# EAGLE schematic PDB2 (EAGLE 9.5.1)
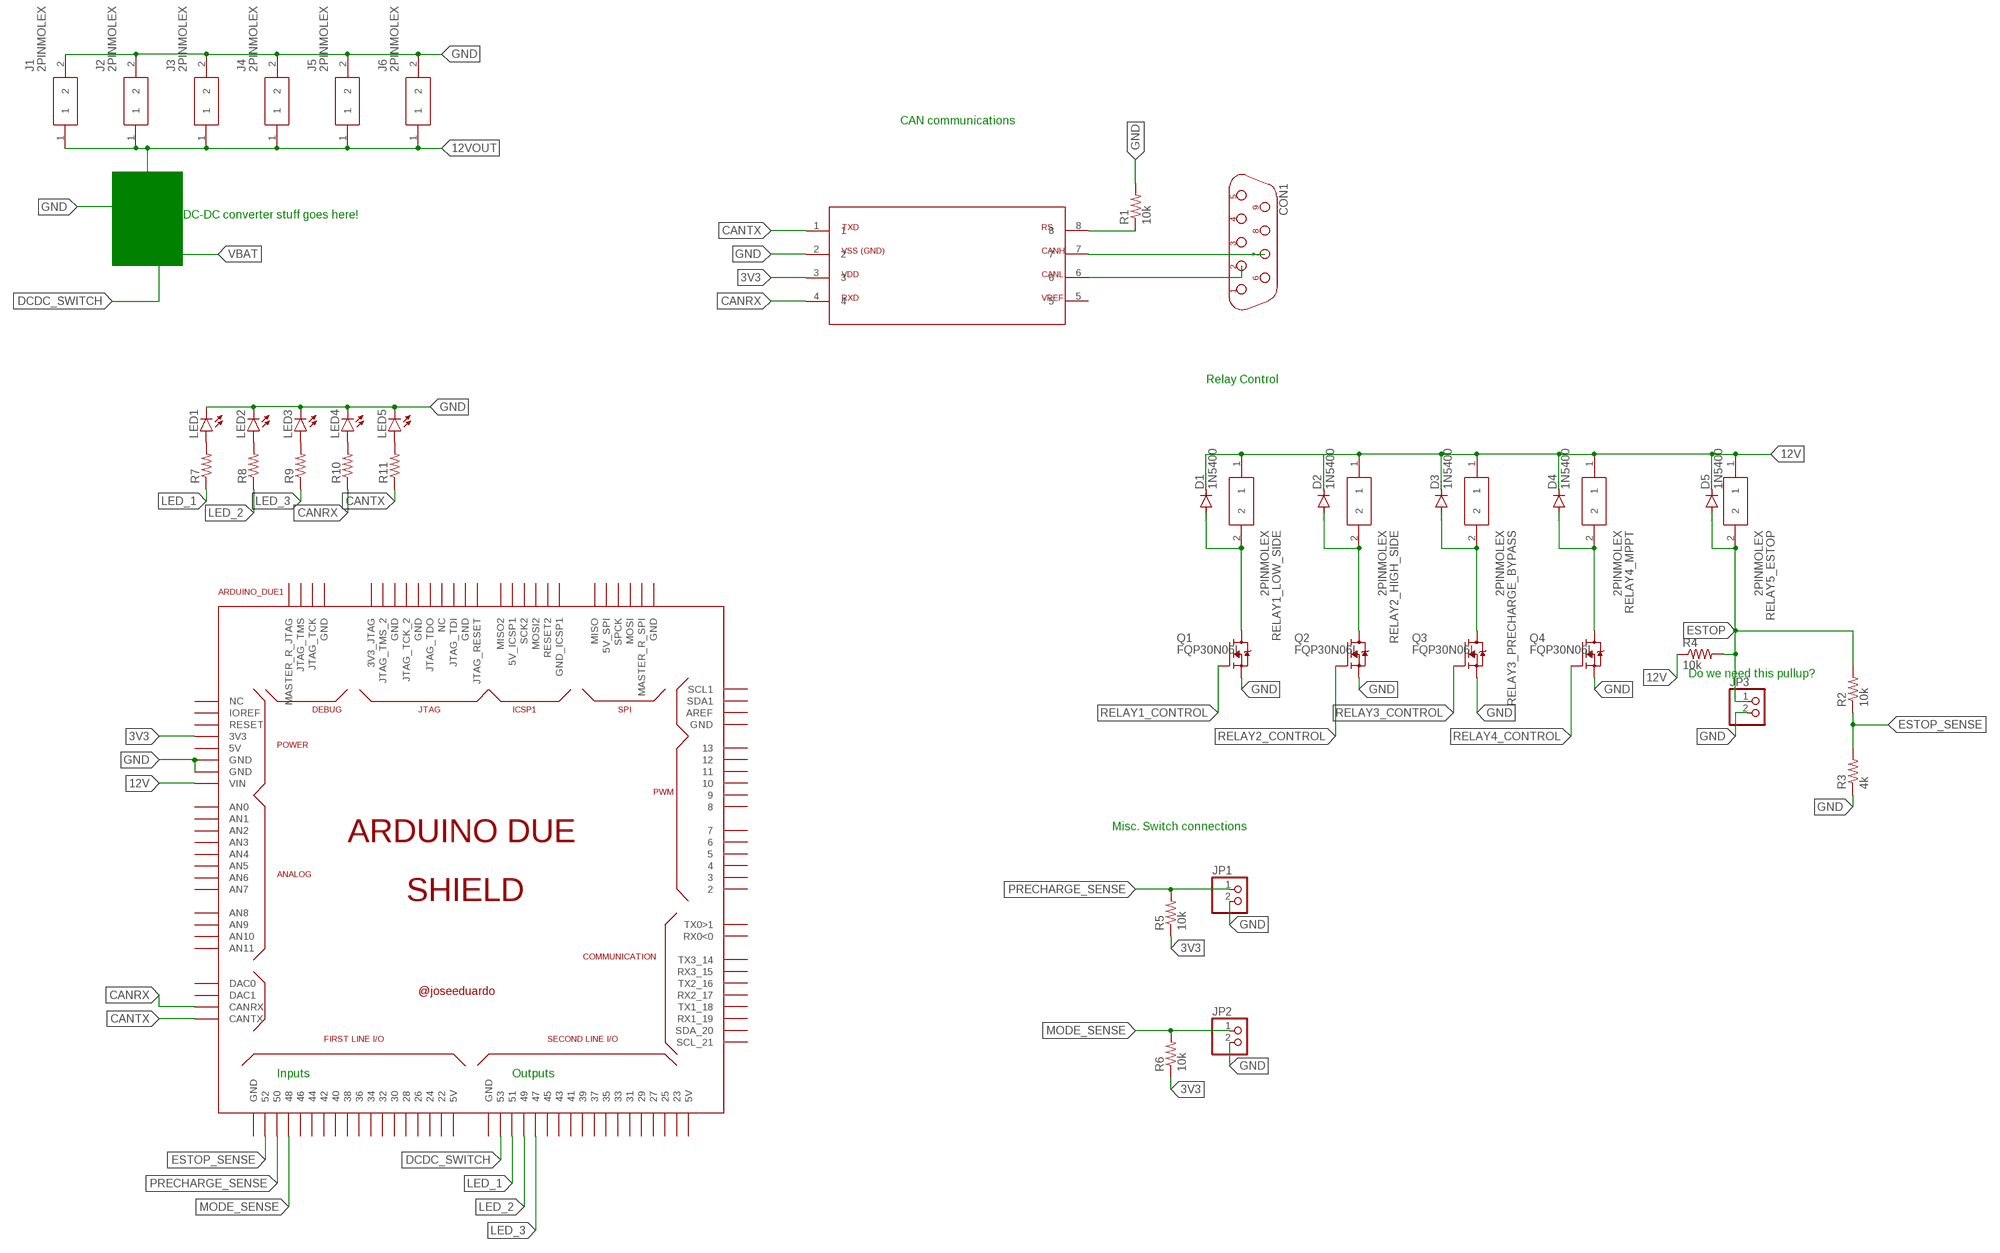
[diagram p0: schematic, sheet 1]

## Parts
ARDUINO_DUE1  ARDUINO_DUE_SHIELD  [ARDUINO_DUE_SHIELD]
CON1  DB9F  [D-09F]
D1  1N5400  [DO201-15]
D2  1N5400  [DO201-15]
D3  1N5400  [DO201-15]
D4  1N5400  [DO201-15]
D5  1N5400  [DO201-15]
J1  2PINMOLEX  [768250002]
J2  2PINMOLEX  [768250002]
J3  2PINMOLEX  [768250002]
J4  2PINMOLEX  [768250002]
J5  2PINMOLEX  [768250002]
J6  2PINMOLEX  [768250002]
JP1  PINHD-1X2  [1X02]
JP2  PINHD-1X2  [1X02]
JP3  PINHD-1X2  [1X02]
LED1  LED5MM  [LED5MM]
LED2  LED5MM  [LED5MM]
LED3  LED5MM  [LED5MM]
LED4  LED5MM  [LED5MM]
LED5  LED5MM  [LED5MM]
Q1  FQP30N06L  [TO220V]
Q2  FQP30N06L  [TO220V]
Q3  FQP30N06L  [TO220V]
Q4  FQP30N06L  [TO220V]
R1  10k  R-US_0204/7  [0204/7]
R2  10k  R-US_0204/7  [0204/7]
R3  4k  R-US_0204/7  [0204/7]
R4  10k  R-US_0204/7  [0204/7]
R5  10k  R-US_0204/7  [0204/7]
R6  10k  R-US_0204/7  [0204/7]
R7  R-US_0204/7  [0204/7]
R8  R-US_0204/7  [0204/7]
R9  R-US_0204/7  [0204/7]
R10  R-US_0204/7  [0204/7]
R11  R-US_0204/7  [0204/7]
RELAY1_LOW_SIDE  2PINMOLEX  [768250002]
RELAY2_HIGH_SIDE  2PINMOLEX  [768250002]
RELAY3_PRECHARGE_BYPASS  2PINMOLEX  [768250002]
RELAY4_MPPT  2PINMOLEX  [768250002]
RELAY5_ESTOP  2PINMOLEX  [768250002]
U$1  3.3VTRANSOIC-8  [SOIC8]

## Nets
3V3: ARDUINO_DUE1.3V3 R5.1 R6.1 U$1.3
12V: ARDUINO_DUE1.VIN D1.C D2.C D3.C D4.C D5.C R4.1 RELAY1_LOW_SIDE.1 RELAY2_HIGH_SIDE.1 RELAY3_PRECHARGE_BYPASS.1 RELAY4_MPPT.1 RELAY5_ESTOP.1
12VOUT: J1.1 J2.1 J3.1 J4.1 J5.1 J6.1
CANRX: ARDUINO_DUE1.CANRX R10.1 U$1.4
CANTX: ARDUINO_DUE1.CANTX R11.1 U$1.1
DCDC_SWITCH: ARDUINO_DUE1.53
ESTOP: D5.A JP3.1 R2.2 R4.2 RELAY5_ESTOP.2
ESTOP_SENSE: ARDUINO_DUE1.52 R2.1 R3.2
GND: ARDUINO_DUE1.GND ARDUINO_DUE1.GND_1(GND) J1.2 J2.2 J3.2 J4.2 J5.2 J6.2 JP1.2 JP2.2 JP3.2 LED1.K(C) LED2.K(C) LED3.K(C) LED4.K(C) LED5.K(C) Q1.3(S) Q2.3(S) Q3.3(S) Q4.3(S) R1.2 R3.1 U$1.2
LED_1: ARDUINO_DUE1.51 R7.1
LED_2: ARDUINO_DUE1.49 R8.1
LED_3: ARDUINO_DUE1.47 R9.1
MODE_SENSE: ARDUINO_DUE1.48 JP2.1 R6.2
N$1: R1.1 U$1.8
N$2: CON1.7 U$1.7
N$3: CON1.2 U$1.6
N$4: LED1.A R7.2
N$5: LED2.A R8.2
N$6: LED3.A R9.2
N$7: LED4.A R10.2
N$8: D1.A Q1.2(D) RELAY1_LOW_SIDE.2
N$9: D2.A Q2.2(D) RELAY2_HIGH_SIDE.2
N$10: LED5.A R11.2
N$11: D3.A Q3.2(D) RELAY3_PRECHARGE_BYPASS.2
N$13: D4.A Q4.2(D) RELAY4_MPPT.2
PRECHARGE_SENSE: ARDUINO_DUE1.50 JP1.1 R5.2
RELAY1_CONTROL: Q1.1(G)
RELAY2_CONTROL: Q2.1(G)
RELAY3_CONTROL: Q3.1(G)
RELAY4_CONTROL: Q4.1(G)
Unconnected: ARDUINO_DUE1.0(RX0<0) ARDUINO_DUE1.1(TX0>1) ARDUINO_DUE1.2 ARDUINO_DUE1.3 ARDUINO_DUE1.3V3_JTAG ARDUINO_DUE1.4 ARDUINO_DUE1.5 ARDUINO_DUE1.5V0(5V) ARDUINO_DUE1.5V0_1(5V) ARDUINO_DUE1.5V0_2(5V) ARDUINO_DUE1.5V_2(5V_SPI) ARDUINO_DUE1.5V_ICSP1 ARDUINO_DUE1.6 ARDUINO_DUE1.7 ARDUINO_DUE1.8 ARDUINO_DUE1.9 ARDUINO_DUE1.10 ARDUINO_DUE1.11 ARDUINO_DUE1.12 ARDUINO_DUE1.13 ARDUINO_DUE1.14(TX3_14) ARDUINO_DUE1.15(RX3_15) ARDUINO_DUE1.16(TX2_16) ARDUINO_DUE1.17(RX2_17) ARDUINO_DUE1.18(TX1_18) ARDUINO_DUE1.19(RX1_19) ARDUINO_DUE1.20(SDA_20) ARDUINO_DUE1.21(SCL_21) ARDUINO_DUE1.22 ARDUINO_DUE1.23 ARDUINO_DUE1.24 ARDUINO_DUE1.25 ARDUINO_DUE1.26 ARDUINO_DUE1.27 ARDUINO_DUE1.28 ARDUINO_DUE1.29 ARDUINO_DUE1.30 ARDUINO_DUE1.31 ARDUINO_DUE1.32 ARDUINO_DUE1.33 ARDUINO_DUE1.34 ARDUINO_DUE1.35 ARDUINO_DUE1.36 ARDUINO_DUE1.37 ARDUINO_DUE1.38 ARDUINO_DUE1.39 ARDUINO_DUE1.40 ARDUINO_DUE1.41 ARDUINO_DUE1.42 ARDUINO_DUE1.43 ARDUINO_DUE1.44 ARDUINO_DUE1.45 ARDUINO_DUE1.46 ARDUINO_DUE1.A0(AN0) ARDUINO_DUE1.A1(AN1) ARDUINO_DUE1.A2(AN2) ARDUINO_DUE1.A3(AN3) ARDUINO_DUE1.A4(AN4) ARDUINO_DUE1.A5(AN5) ARDUINO_DUE1.A6(AN6) ARDUINO_DUE1.A7(AN7) ARDUINO_DUE1.A8(AN8) ARDUINO_DUE1.A9(AN9) ARDUINO_DUE1.A10(AN10) ARDUINO_DUE1.A11(AN11) ARDUINO_DUE1.AREF ARDUINO_DUE1.DAC0 ARDUINO_DUE1.DAC1 ARDUINO_DUE1.GND_2(GND) ARDUINO_DUE1.GND_3(GND) ARDUINO_DUE1.GND_4(GND) ARDUINO_DUE1.GND_5(GND) ARDUINO_DUE1.GND_7(GND) ARDUINO_DUE1.GND_8(GND) ARDUINO_DUE1.GND_9(GND) ARDUINO_DUE1.GND_10(GND) ARDUINO_DUE1.GND_ICSP1 ARDUINO_DUE1.IOREF ARDUINO_DUE1.JTAG_RESET ARDUINO_DUE1.JTAG_TCK ARDUINO_DUE1.JTAG_TCK_2 ARDUINO_DUE1.JTAG_TDI ARDUINO_DUE1.JTAG_TDO ARDUINO_DUE1.JTAG_TMS ARDUINO_DUE1.JTAG_TMS_2 ARDUINO_DUE1.MASTER_RESET_JTAG(MASTER_R_JTAG) ARDUINO_DUE1.MASTER_RESET_SPI(MASTER_R_SPI) ARDUINO_DUE1.MISO ARDUINO_DUE1.MISO2 ARDUINO_DUE1.MOSI ARDUINO_DUE1.MOSI2 ARDUINO_DUE1.NC_2(NC) ARDUINO_DUE1.NC_5(NC) ARDUINO_DUE1.RESET ARDUINO_DUE1.RESET2 ARDUINO_DUE1.SCK2 ARDUINO_DUE1.SCL1 ARDUINO_DUE1.SDA1 ARDUINO_DUE1.SPCK CON1.1 CON1.3 CON1.4 CON1.5 CON1.6 CON1.8 CON1.9 U$1.5

## Notes on the sheet
- CAN communications
- DC-DC converter stuff goes here!
- Relay Control
- Do we need this pullup?
- Misc. Switch connections
- Inputs | Outputs

## Library data of the parts
ARDUINO_DUE1 = arduino_due_shield:ARDUINO_DUE_SHIELD
CON1 = connect:DB9F
D1-D5 = diode:1N5400: DIODE standard rectifier, 3 A, 50 V (Motorola)
J1-J6 RELAY1_LOW_SIDE RELAY2_HIGH_SIDE RELAY3_PRECHARGE_BYPASS RELAY4_MPPT RELAY5_ESTOP = Solar_Library:2PINMOLEX: MOLEX - 76825-0002 - CONNECTOR, HEADER, 2POS, 2ROW, 5.7MM Source: Datasheet <https://www.molex.com/pdm_docs/sd/768250002_sd.pdf>; ALLIED_NUMBER: 70717238; ALLIED_PRICE-STOCK: https://www.alliedelec.com/molex-incorporated-76825-0002/70717238/; DESCRIPTION: MOLEX - 76825-0002 - CONNECTOR, HEADER, 2POS, 2ROW, 5.7MM; HEIGHT: 14mm; MANUFACTURER_NAME: Molex; MANUFACTURER_PART_NUMBER: 76825-0002; MOUSER_PART_NUMBER: 538-76825-0002; MOUSER_PRICE-STOCK: https://www.mouser.com/Search/Refine.aspx?Keyword=538-76825-0002; RS_PART_NUMBER: 1790654; RS_PRICE-STOCK: https://uk.rs-online.com/web/p/products/1790654
JP1-JP3 = pinhead:PINHD-1X2: PIN HEADER
LED1-LED5 = led:LED: LED OSRAM: - CHIPLED LG R971, LG N971, LY N971, LG Q971, LY Q971, LO R971, LY R971 LH N974, LH R974 LS Q976, LO Q976, LY Q976 LO Q996 - Hyper CHIPLED LW Q18S LB Q993, LB Q99A, LB R99A - SideLED LS A670, LO A670, LY A670, LG A670, LP A670 LB A673, LV A673, LT A673, LW A673 LH A674 LY A675 LS A676, LA A676, LO A676, LY A676, LW A676 LS A679, LY A679, LG A679 - Hyper Micro SIDELED® LS Y876, LA Y876, LO Y876, LY Y876 LT Y87S - SmartLED LW L88C, LW L88S LB L89C, LB L89S, LG L890 LS L89K, LO L89K, LY L89K LS L896, LA L896, LO L896, LY L896 - TOPLED LS T670, LO T670, LY T670, LG T670, LP T670 LSG T670, LSP T670, LSY T670, LOP T670, LYG T670 LG T671, LOG T671, LSG T671 LB T673, LV T673, LT T673, LW T673 LH T674 LS T676, LA T676, LO T676, LY T676, LB T676, LH T676, LSB T676, LW T676 LB T67C, LV T67C, LT T67C, LS T67K, LO T67K, LY T67K, LW E67C LS E67B, LA E67B, LO E67B, LY E67B, LB E67C, LV E67C, LT E67C LW T67C LS T679, LY T679, LG T679 LS T770, LO T770, LY T770, LG T770, LP T770 LB T773, LV T773, LT T773, LW T773 LH T774 LS E675, LA E675, LY E675, LS T675 LS T776, LA T776, LO T776, LY T776, LB T776 LHGB T686 LT T68C, LB T68C - Hyper Mini TOPLED® LB M676 - Mini TOPLED Santana® LG M470 LS M47K, LO M47K, LY M47K Source: http://www.osram.convergy.de LUXEON: - LUMILED® LXK2-PW12-R00, LXK2-PW12-S00, LXK2-PW14-U00, LXK2-PW14-V00 LXK2-PM12-R00, LXK2-PM12-S00, LXK2-PM14-U00 LXK2-PE12-Q00, LXK2-PE12-R00, LXK2-PE12-S00, LXK2-PE14-T00, LXK2-PE14-U00 LXK2-PB12-K00, LXK2-PB12-L00, LXK2-PB12-M00, LXK2-PB14-N00, LXK2-PB14-P00, LXK2-PB14-Q00 LXK2-PR12-L00, LXK2-PR12-M00, LXK2-PR14-Q00, LXK2-PR14-R00 LXK2-PD12-Q00, LXK2-PD12-R00, LXK2-PD12-S00 LXK2-PH12-R00, LXK2-PH12-S00 LXK2-PL12-P00, LXK2-PL12-Q00, LXK2-PL12-R00 Source: www.luxeon.com KINGBRIGHT: KA-3528ASYC Source: www.kingbright.com
Q1-Q4 = FQP30N06L:FQP30N06L: N-Channel QFET® MOSFET Source: Data Sheet; AVAILABILITY: Unavailable; DESCRIPTION: MOSFET Transistor, N Channel, 32 A, 60 V, 27 mohm, 10 V, 2.5 V; MF: ON Semiconductor; MP: FQP30N06L; PACKAGE: TO-220 ON Semiconductor; PRICE: None
R1-R6 = resistor:R-US_: RESISTOR, American symbol
R7-R11 = rcl:R-US_: RESISTOR, American symbol; SPICEPREFIX: R
U$1 = Solar_Library:3.3VTRAN